# EasyEDA Pro project PCI_Ponte retificadora.epro

# Schematic Schematic2
Board Name: Schematic2; Create Date: 2025-02-21; Page Name: P1; Project Name: Ponte retificadora; Schematic Name: Schematic2; Update Date: 2025-02-21; Company: EasyEDA.com; Page Size: A4; Version: V1.0
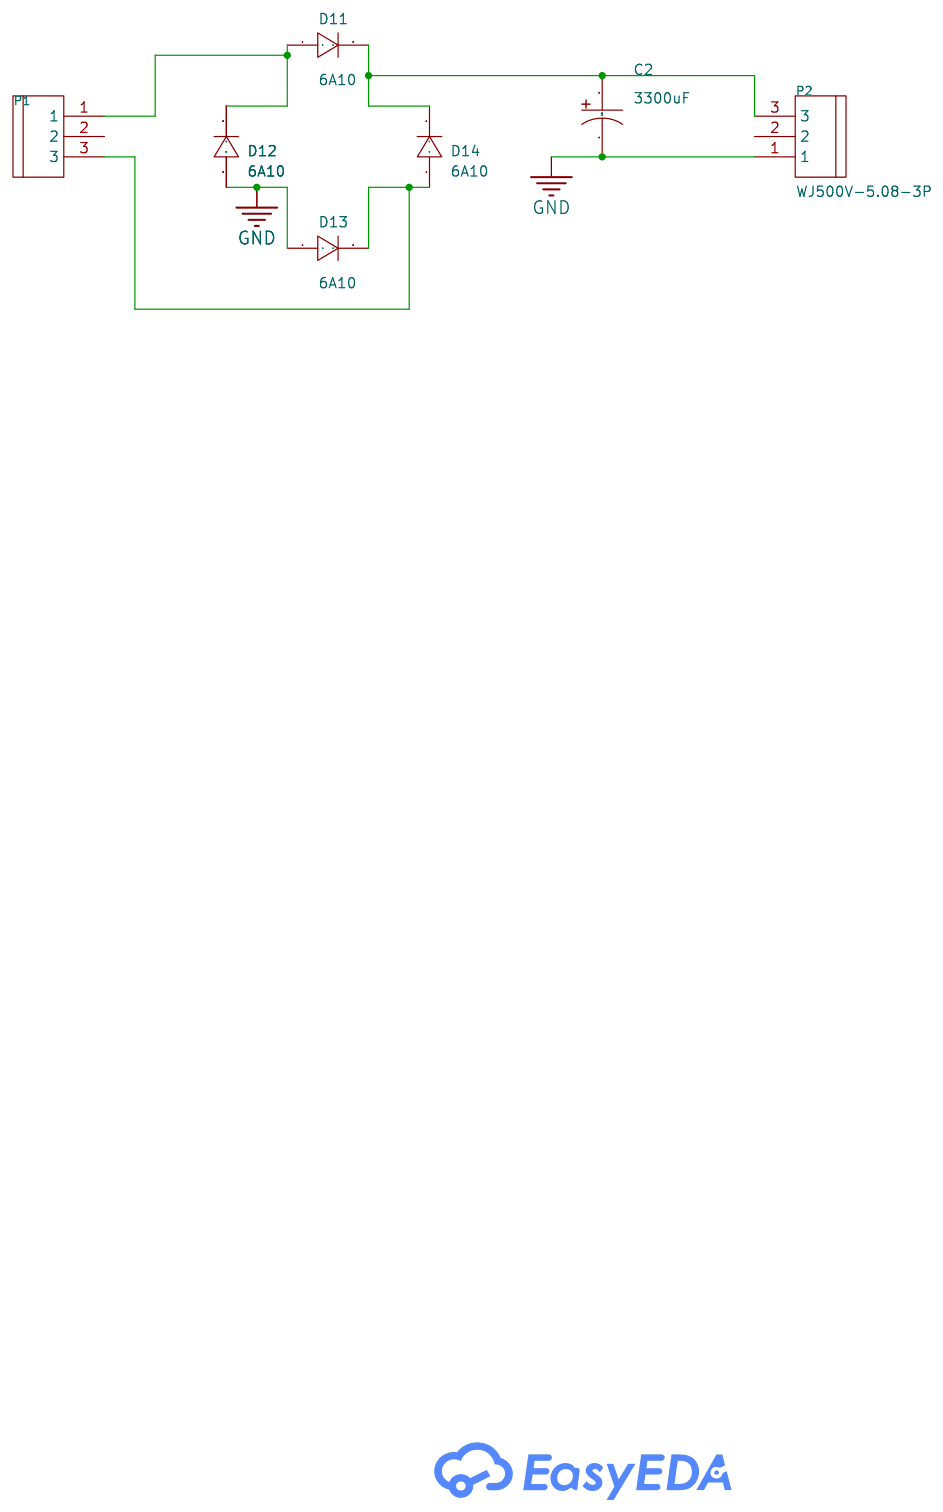
[diagram p0: schematic sheet]

## Parts
C2  3300uF  [CAP-TH_BD40.0-P10.00-D2.3-FD]
D11  6A10  [R-6_BD9.0-L9.0-W9.0-P15.00-D1.7-FD]
D12  6A10  [R-6_BD9.0-L9.0-W9.0-P15.00-D1.7-FD]
D13  6A10  [R-6_BD9.0-L9.0-W9.0-P15.00-D1.7-FD]
D14  6A10  [R-6_BD9.0-L9.0-W9.0-P15.00-D1.7-FD]
P1  WJ500V-5.08-3P  [CONN-TH_3P-P5.00_WJ500V-5.08-3P]
P2  WJ500V-5.08-3P  [CONN-TH_3P-P5.00_WJ500V-5.08-3P]

## Library data of the parts
C2 = RP2G561MT350S68CE0: Capacitance: Tolerance:±20% Tolerance:±20% Rated Voltage: Lead Spacing: Equivalent Series Resistance (ESR):- Ripple Current:- φD: L: Lifetime @ Temperature:2000hrs@105℃ Operating Temperature:-25℃~+105℃ Operating Temperature:-25℃~+105℃; LCSC Part Name: 560uF ±20% 400V; Supplier Part: C240476; Manufacturer: HUAWEI(华威集团); Supplier Footprint: 插件,D40xL35mm; JLCPCB Part Class: Extended Part; Datasheet: https://atta.szlcsc.com/upload/public/pdf/source/20180730/C240476_1EFDEDE985143EC11B6638D9160DF286.pdf; Supplier: LCSC; Tolerance: ±20%; Lifetime @ Temperature: 2000hrs@105℃; Operating Temperature: -25℃~+105℃
D11-D14 = 6A10_C2461: Diode Configuration: Forward Voltage (Vf@If):1V@6A Reverse Voltage (Vr): Rectified Current: Reverse Leakage Current:10uA@1kV; LCSC Part Name: 电压:1kV 电流:6A; Supplier Part: C2461; Manufacturer: MDD(辰达半导体); Supplier Footprint: R-6; JLCPCB Part Class: Extended Part; Datasheet: https://atta.szlcsc.com/upload/public/pdf/source/20230823/97B9A745DC21681A6BE4AF02CDC85626.pdf; Supplier: LCSC; Forward Voltage (Vf@If): 1V@6A; Reverse Leakage Current: 10uA@1kV
P1 P2 = WJ500V-5.08-3P: Structure:1x3P Pitch:5.08mm Color:Green Mounting Style:Straight Current Rating (Max):18A Voltage Rating (Max):250V Number of Pins:3P Number of Rows:1 Wire Gauge - AWG:14~30 Wire Gauge - AWG:14~30 Wire Gauge - mm2:2.5 Wire Gauge - mm2:2.5 Number of PINs Pe; LCSC Part Name: 5.08mm 1x3P 排数:1 每排P数:3 直插; Supplier Part: C72334; Manufacturer: KANGNEX(康奈克斯电气); Supplier Footprint: 插件,P=5.08mm; JLCPCB Part Class: Extended Part; Datasheet: https://atta.szlcsc.com/upload/public/pdf/source/20191225/C72334_8A5EF831D67650233B6B1E3F2BC06274.pdf; Supplier: LCSC; Structure: 1x3P; Pitch: 5.08mm; Color: Green; Mounting Style: Straight; Current Rating (Max): 18A; Voltage Rating (Max): 250V; Number of Pins: 3P; Number of Rows: 1; Wire Gauge - AWG: 14~30; Wire Gauge - mm2: 2.5; Number of PINs Per Row: 3; Operating Temperature Range: -40℃~+105℃

## Nets
GND: C2.2 D12.1(A) D13.1(A) P2.1
$1N1260: D11.1(A) D12.2(K) P1.1
$1N1264: C2.1 D11.2(K) D14.2(K) P2.3
$1N1266: D13.2(K) D14.1(A) P1.3

Not connected (* = marked no-connect by the designer): P1 2; P2 2

# Board PCB_trifasico
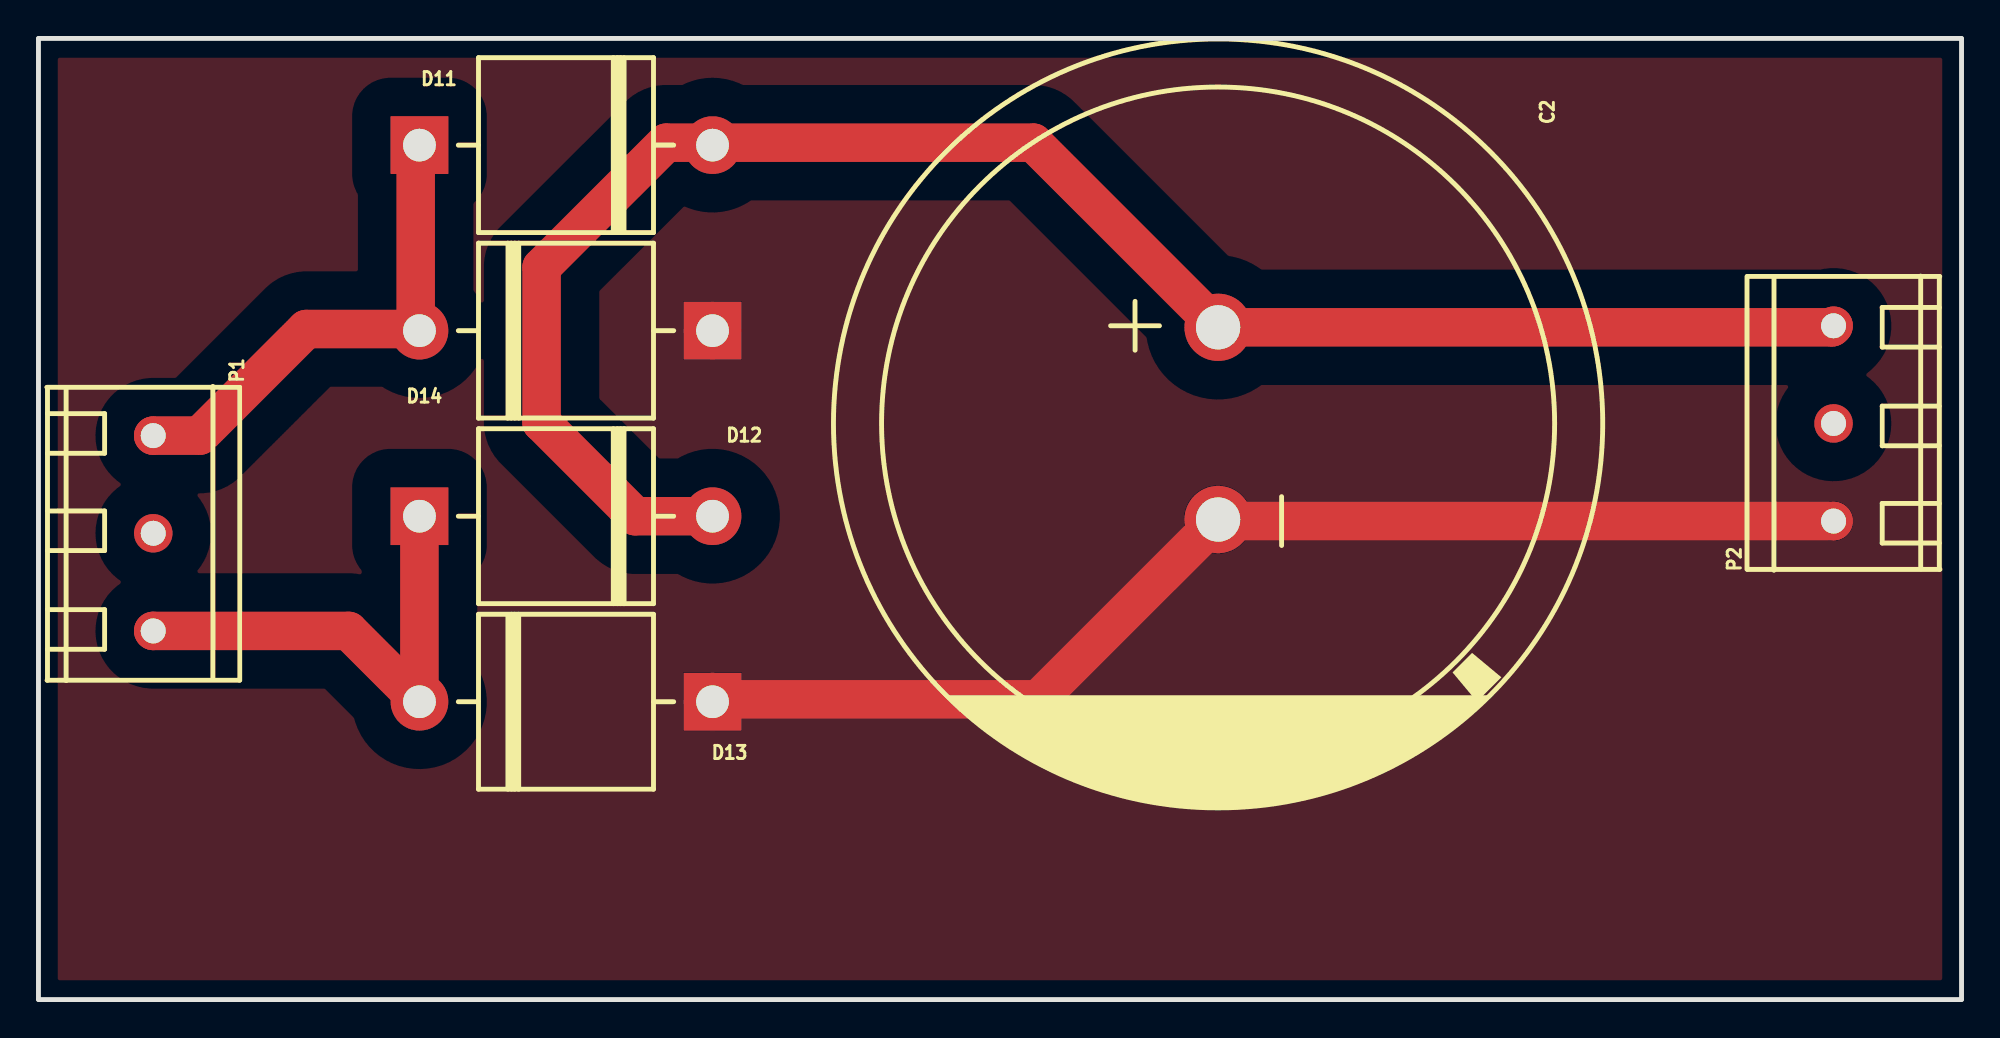
[diagram p1: board, top side]
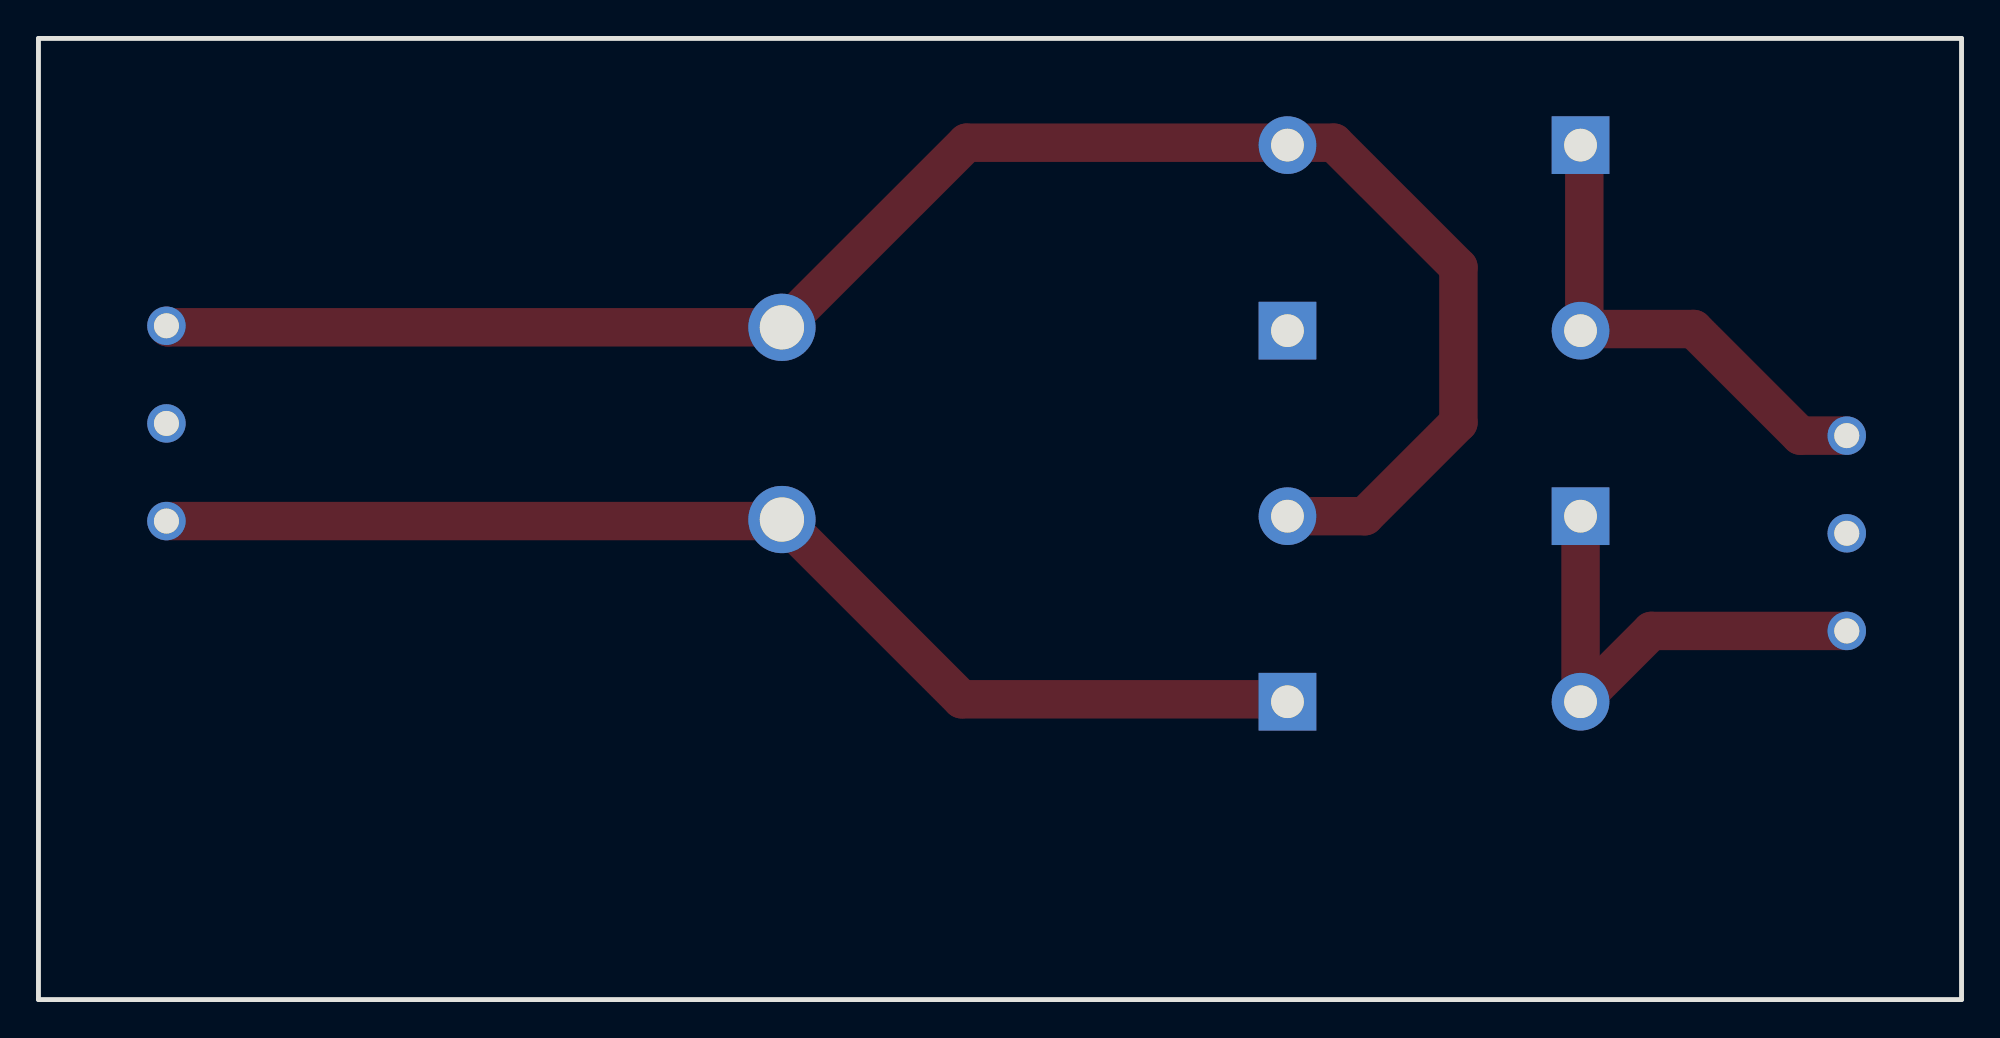
[diagram p2: board, bottom side, seen from below]

Outline 100 x 50 mm; copper layers: Top Layer, Bottom Layer. Coordinates in mm from the lower left corner of the outline.
Outline path: 0,50 100,50 100,0 0,0 0,50
Stack: Top Layer 0.035mm / Dielectric1 1.51mm FR4 er 4.5 / Bottom Layer 0.035mm

## Design rules (mm)
template: User Custom Config
spacing Default (default): track to track 0.152, other pairs 0 to 0.152
track width Default (default): min 0.254, default 0.254, max 25.4
differential pair differentialPair (default): width min 0.127, default 0.254, max 2.54; gap min 0.152, default 0.152
via Default (default): diameter min 0.61, default 0.61, max 100.025; hole min 0.305, default 0.305, max 59.995

## Placement (name value [footprint] x y rotation side)
C2  3300uF  [CAP-TH_BD40.0-P10.00-D2.3-FD]  61.34 29.97 270 top
D11  6A10  [R-6_BD9.0-L9.0-W9.0-P15.00-D1.7-FD]  27.43 44.45 0 top
D12  6A10  [R-6_BD9.0-L9.0-W9.0-P15.00-D1.7-FD]  27.43 34.8 180 top
D13  6A10  [R-6_BD9.0-L9.0-W9.0-P15.00-D1.7-FD]  27.43 15.49 180 top
D14  6A10  [R-6_BD9.0-L9.0-W9.0-P15.00-D1.7-FD]  27.43 25.15 0 top
P1  WJ500V-5.08-3P  [CONN-TH_3P-P5.00_WJ500V-5.08-3P]  5.97 24.26 270 top
P2  WJ500V-5.08-3P  [CONN-TH_3P-P5.00_WJ500V-5.08-3P]  93.34 29.97 90 top

## Footprints (pads in the part's own frame, mm; a bottom-side part is the same pattern mirrored in y, then rotated)
CAP-TH_BD40.0-P10.00-D2.3-FD
  round 3.5 hole 2.3: 1(-5,0) 2(5,0)
CONN-TH_3P-P5.00_WJ500V-5.08-3P
  round 2 hole 1.3: 1(-5.08,0) 2(0,0) 3(5.08,0)
R-6_BD9.0-L9.0-W9.0-P15.00-D1.7-FD
  rect 3x3 hole 1.7: 1(-7.62,0)
  round 3 hole 1.7: 2(7.62,0)

## Nets
As in the schematic.

Pads without a net: P1 2; P2 2

## Routing (per net, layer and track width the routed paths; a pad name or vN(x,y) marks a point on that pad's centre or on a via; arc(x,y) is an arc through that point)
GND: length 62.3
  Top Layer w2: P2.1 61.42,24.89 C2.2 51.99,15.62 35.18,15.62 D13.1
$1N1260: length 24.7
  Top Layer w2: P1.1 8.38,29.34 13.93,34.88 19.62,34.88 19.62,43.69
$1N1264: length 92
  Top Layer w2: P2.3 93.26,34.97 C2.1 51.74,44.58 32.64,44.58 26.16,38.1 26.16,30.01 31.03,25.15 34.16,25.15
$1N1266: length 25
  Top Layer w2: P1.3 16.13,19.18 D13.2 D14.1

## Copper pours and planes (outline as drawn; the poured copper is in the pictures)
GND on Top Layer: 0,49.75 100,49.75 100,-0.25 0,-0.25

## Text on the board
Document Layer: Data de Emissão: 20/02/2025 / Equipe Técnica: Paulo G. L. Xavier, João P. F. da Silva / Tipo de Documento: Retificador monofasico de onda completa / Número de Identificação: EP_2024_2-G / Revisado por: Paulo G. L. Xavier, João P. F. da Silva / Data da Revisão: 21/02/2025 / Versão do Projeto: 2024_2_rev1
